# EAGLE design AMP_1_0 (EAGLE 8.3.2)
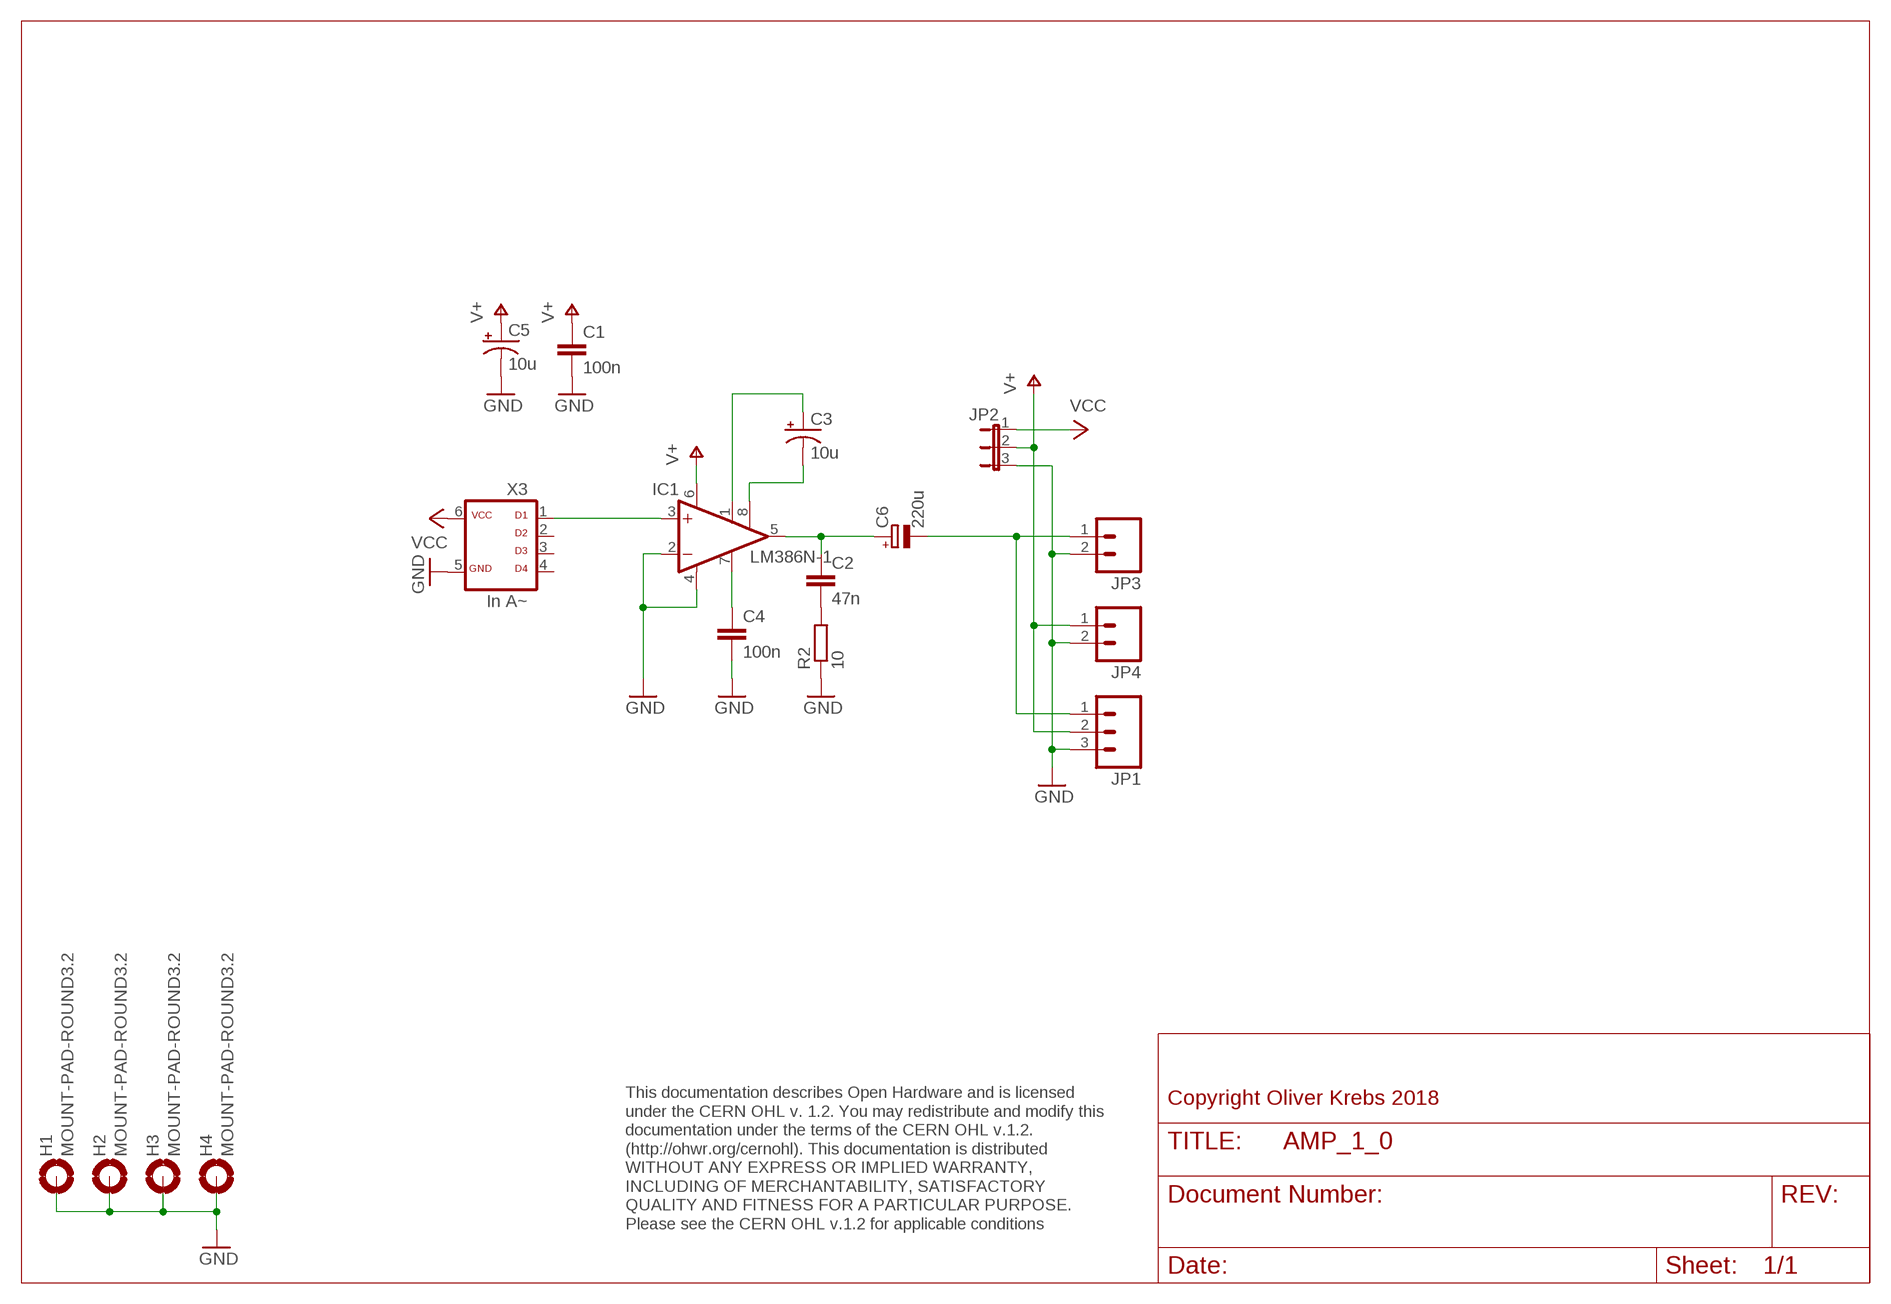
[diagram p0: schematic, sheet 1]

## Parts
C1  100n  C-EU050-025X075  [C050-025X075]
C2  47n  C-EU050-025X075  [C050-025X075]
C3  10u  CAP_POLPTH2  [CPOL-RADIAL-10UF-25V]
C4  100n  C-EU050-025X075  [C050-025X075]
C5  10u  CAP_POLPTH2  [CPOL-RADIAL-10UF-25V]
C6  220u  CPOL-EUE3.5-8  [E3,5-8]
H1  MOUNT-PAD-ROUND3.2  [3,2-PAD]
H2  MOUNT-PAD-ROUND3.2  [3,2-PAD]
H3  MOUNT-PAD-ROUND3.2  [3,2-PAD]
H4  MOUNT-PAD-ROUND3.2  [3,2-PAD]
IC1  LM386N-1  [DIL08]
JP1  M03PTH  [1X03]
JP2  JP2EJP2-U  [JP2-U]
JP3  M021.3MM-5.08  [1X02_BIG_5.08]
JP4  M021.3MM-5.08  [1X02_BIG_5.08]
R2  10  R-EU_0207/10  [0207/10]
X3  In A~  ML6D  [ML-6]

## Nets
GND: C1.2 C4.2 C5.2(-) H1.B3,2(MOUNT) H2.B3,2(MOUNT) H3.B3,2(MOUNT) H4.B3,2(MOUNT) IC1.2(-IN) IC1.4(GND) JP1.3 JP2.3 JP3.2 JP4.2 R2.1 X3.5
N$1: C3.2(-) IC1.8(GAIN)
N$2: C3.1(+) IC1.1(GAIN)
N$3: IC1.3(+IN) X3.1
N$8: C4.1 IC1.7(BYPASS)
N$9: C2.1 C6.+ IC1.5(OUT)
N$10: C2.2 R2.2
N$11: C6.- JP1.1 JP3.1
V+: C1.1 C5.1(+) IC1.6(VS) JP1.2 JP2.2 JP4.1
VCC: JP2.1 X3.6
Unconnected: X3.2 X3.3 X3.4

## Notes on the sheet
- Copyright Oliver Krebs 2018
- This documentation describes Open Hardware and is licensed 
  under the CERN OHL v. 1.2. You may redistribute and modify this 
  documentation under the terms of the CERN OHL v.1.2. 
  (http://ohwr.org/cernohl). This documentation is distributed
  WITHOUT ANY EXPRESS OR IMPLIED WARRANTY, 
  INCLUDING OF MERCHANTABILITY, SATISFACTORY 
  QUALITY AND FITNESS FOR A PARTICULAR PURPOSE. 
  Please see the CERN OHL v.1.2 for applicable conditions

## Library data of the parts
C1 C2 C4 = 01-my_rcl:C-EU: CAPACITOR, European symbol
C3 C5 = SparkFun-Passives:CAP_POL: Capacitor Polarized These are standard SMD and PTH capacitors. Normally 10uF, 47uF, and 100uF in electrolytic and tantalum varieties. Always verify the external diameter of the through hole cap, it varies with capacity, voltage, and manufacturer. The EIA devices should be standard.
C6 = 01-my_rcl:CPOL-EU: POLARIZED CAPACITOR, European symbol
H1-H4 = holes:MOUNT-PAD-ROUND: MOUNTING PAD, round
IC1 = 01-my-linear:LM386?-*: Low Voltage Audio Power Amplifier Source: http://cache.national.com/ds/LM/LM386.pdf
JP1 = SparkFun-Connectors:M03: Header 3 Standard 3-pin 0.1" header. Use with straight break away headers (SKU : PRT-00116), right angle break away headers (PRT-00553), swiss pins (PRT-00743), machine pins (PRT-00117), and female headers (PRT-00115). Molex polarized connector foot print use with SKU : PRT-08232 with associated crimp pins and housings.
JP2 = 01-my-jumper:JP2E: JUMPER
JP3 JP4 = SparkFun-Connectors:M02: Standard 2-pin 0.1" header. Use with - straight break away headers ( PRT-00116) - right angle break away headers (PRT-00553) - swiss pins (PRT-00743) - machine pins (PRT-00117) - female headers (PRT-00115) Molex polarized connector foot print use with: PRT-08233 with associated crimp pins and housings. 2.54_SCREWTERM for use with PRT-10571. 3.5mm Screw Terminal footprints for PRT-08084 5mm Screw Terminal footprints for use with PRT-08432
R2 = 01-my_rcl:R-EU_: RESISTOR, European symbol
X3 = 01-my-con:ML6D

## Board
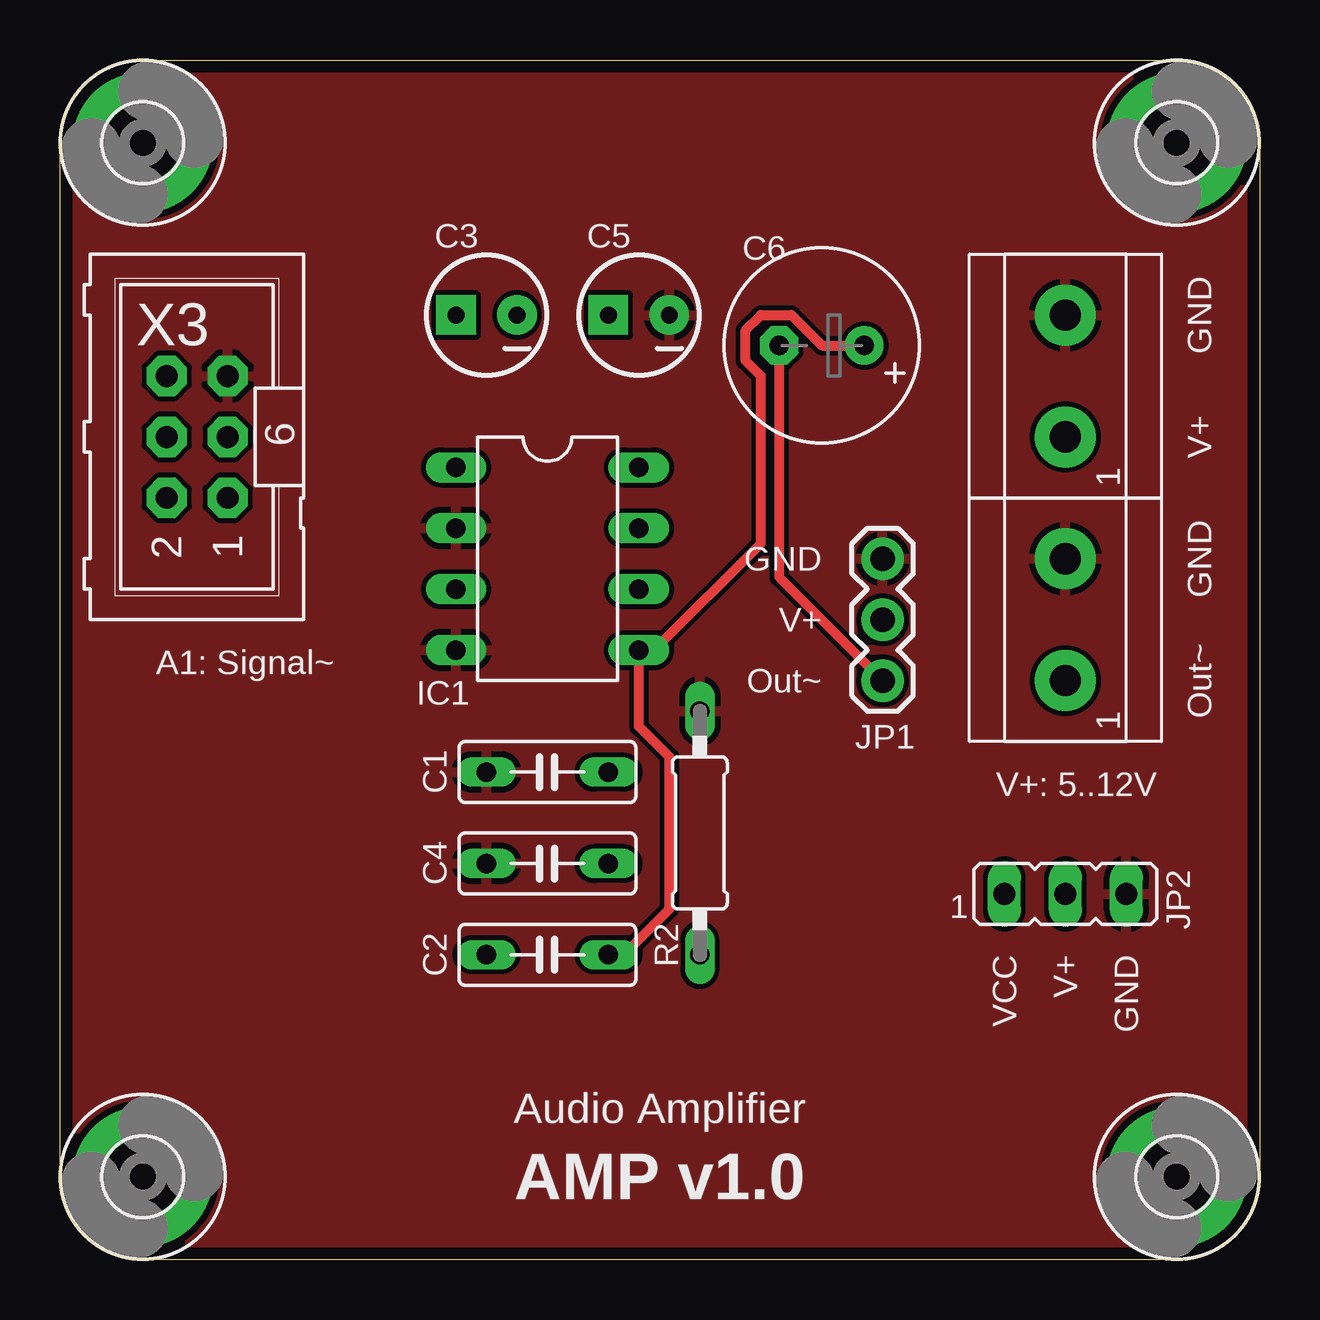
[diagram p1: board, top side]
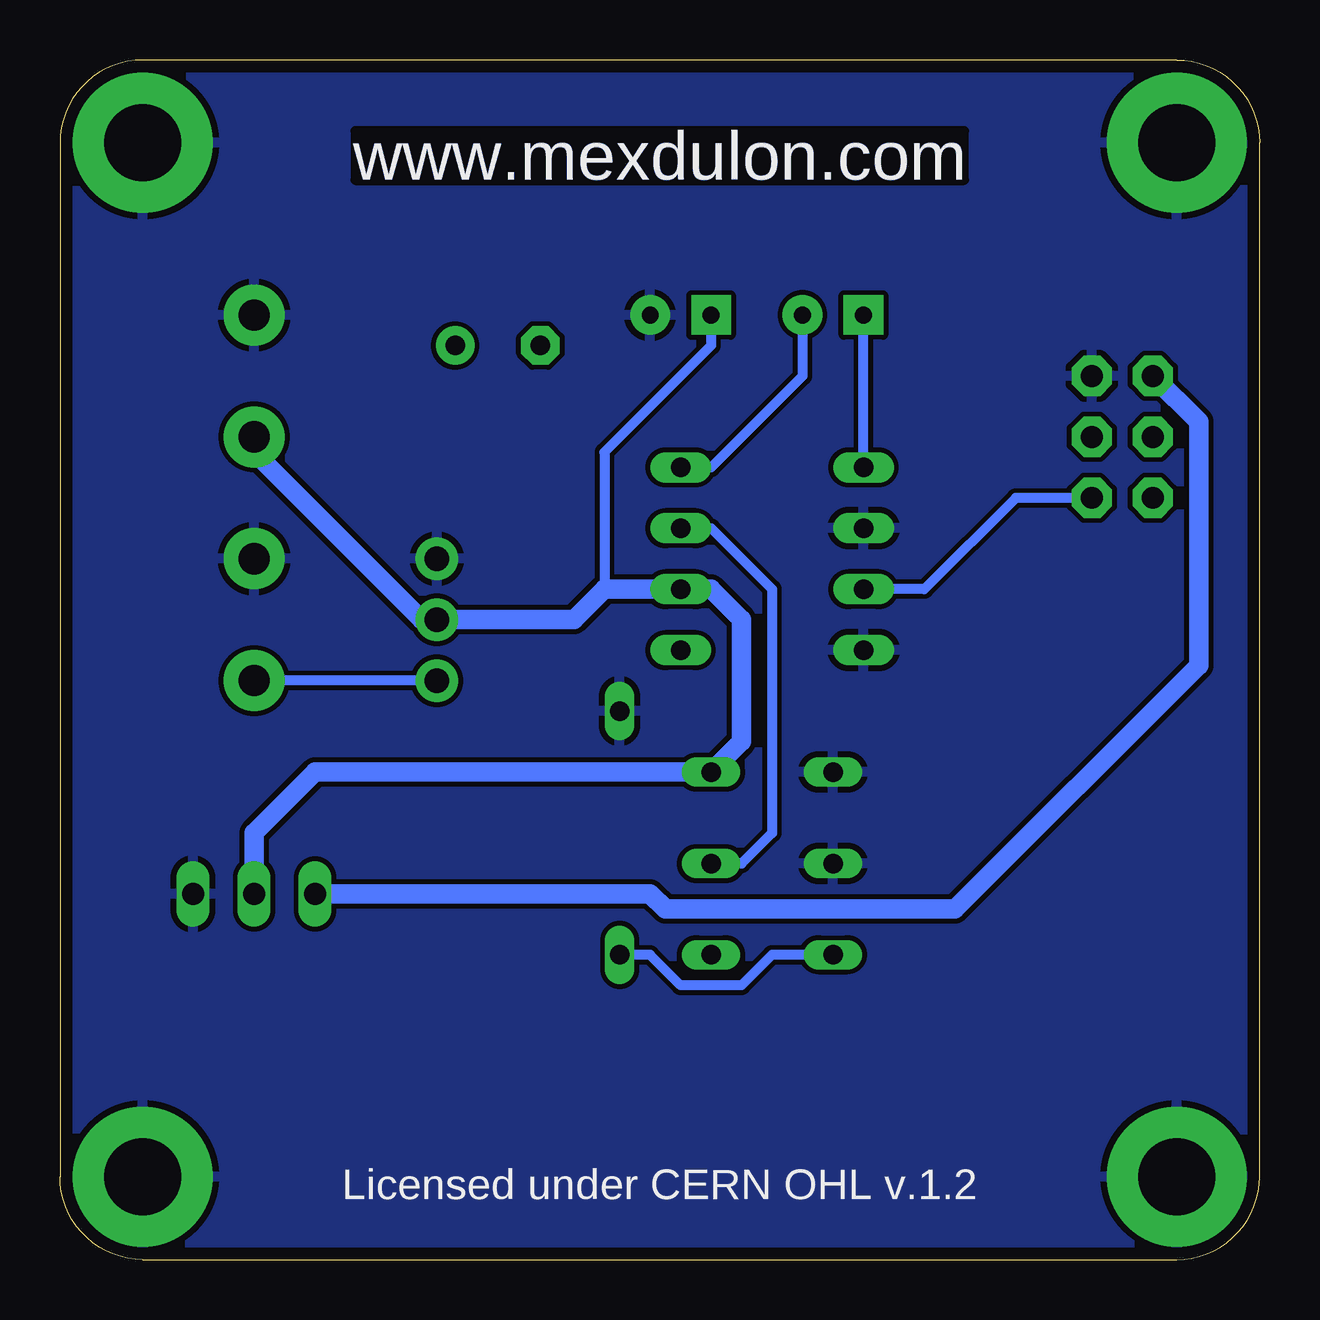
[diagram p2: board, bottom side, seen from below]

Size 50 x 50 mm. Coordinates in mm from the lower left corner, seen from the top.
Outline: 0,3.45 0,46.55 arc-90 3.45,50 46.55,50 arc-90 50,46.55 50,3.45 arc-90 46.55,0 3.45,0 arc-90 0,3.45
Copper layers (1*16): Top 0.035mm / dielectric 1.6mm / Bottom 0.035mm
Design rules "Elecrow_2-layer_PCB_eagle_rule_8mil": minimum track width 8mil, minimum drill 12mil, track to track 8mil, track to pad 8mil, pad to pad 8mil, via to via 8mil, smd to smd 0mil, copper to edge 20mil, drill to drill 10mil, minimum pad ring 6mil, minimum via ring 6mil, stop-mask expansion 0mil, vias tented up to drill 100mil, thermal gap 10mil

### Footprints (pad centres in the part's own frame; a part is rotated, then mirrored left to right if it is on the bottom)
C050-025X075 = drill 0.813 long: 1 -2.54,0; 2 2.54,0
CPOL-RADIAL-10UF-25V = drill 0.7 pad 1.651 square: 1 1.27,0 | drill 0.7 pad 1.651: 2 -1.27,0
E3,5-8 = drill 0.813 pad 1.6: + -1.778,0 | drill 0.813 pad 1.6 octagon: - 1.778,0
3,2-PAD = drill 3.2 pad 5.842: B3,2 0,0
DIL08 = drill 0.813 pad 1.27 long: 1 -3.81,-3.81; 2 -1.27,-3.81; 3 1.27,-3.81; 4 3.81,-3.81; 5 3.81,3.81; 6 1.27,3.81; 7 -1.27,3.81; 8 -3.81,3.81
1X03 = drill 1.016 pad 1.778: 1 0,0; 2 2.54,0; 3 5.08,0
JP2-U = drill 0.914 long: 1 -2.54,0; 2 0,0; 3 2.54,0
1X02_BIG_5.08 = drill 1.3 pad 2.54: 1 -2.54,0; 2 2.54,0
0207/10 = drill 0.813 long: 1 -5.08,0; 2 5.08,0
ML-6 = drill 0.914 pad 1.676 octagon: 1 -2.54,-1.27; 2 -2.54,1.27; 3 0,-1.27; 4 0,1.27; 5 2.54,-1.27; 6 2.54,1.27

### Placement (x,y rotation side)
C1  20.32,20.32 180 top
C2  20.32,12.7 180 top
C3  17.78,39.37 180 top
C4  20.32,16.51 180 top
C5  24.13,39.37 180 top
C6  31.75,38.1 180 top
H1  3.45,3.45 0 top
H2  3.45,46.55 0 top
H3  46.55,46.55 0 top
H4  46.55,3.45 0 top
IC1  20.32,29.21 270 top
JP1  34.29,24.13 90 top
JP2  41.91,15.24 0 top
JP3  41.91,26.67 90 top
JP4  41.91,36.83 90 top
R2  26.67,17.78 270 top
X3  5.71,34.29 90 top

### Tracks (layer width: path | path; a pad name or v marks a point on that pad's centre or on a via)
GND
  pour Bottom (isolate 0.203): 0,50.16 50.8,50.16 50.8,0 0,0
  pour Top (isolate 0.203): 0,50.16 50.8,50.16 50.8,0 0,0
N$1
  Bottom 0.406: C3.2 19.05,36.83 22.86,33.02 IC1.8
N$2
  Bottom 0.406: IC1.1 C3.1
N$3
  Bottom 0.406: X3.1 10.16,31.75 13.97,27.94 IC1.3
N$8
  Bottom 0.406: IC1.7 22.86,30.48 20.32,27.94 20.32,17.78 21.59,16.51 C4.1
N$9
  Top 0.406: C6.+ 31.75,38.1 30.48,39.37 29.21,39.37 28.57,38.73 28.57,37.47 29.21,36.83 29.21,29.84 24.77,25.4 IC1.5 24.13,22.23 25.4,20.95 25.4,14.61 23.5,12.7 C2.1
N$10
  Bottom 0.406: C2.2 20.32,12.7 21.59,11.43 24.13,11.43 25.4,12.7 R2.2
N$11
  Top 0.406: C6.- 29.97,28.45 JP1.1
  Bottom 0.406: JP1.1 JP3.1
V+
  Bottom 0.406: C5.1 22.86,38.1 27.3,33.66 27.3,27.94
  Bottom 0.813: JP4.1 41.91,33.66 34.92,26.67 JP1.2 28.57,26.67 27.3,27.94 IC1.6 22.86,27.94 21.59,26.67 21.59,21.59 C1.1 39.37,20.32 41.91,17.78 JP2.2
VCC
  Bottom 0.813: X3.6 2.54,34.92 2.54,24.77 12.7,14.61 24.77,14.61 25.4,15.24 JP2.1

### Text on the board
Bottom: www.mexdulon.com
tNames: GND | V+ | GND | GND | V+ | A1: Signal~ | Out~ | Out~ | V+: 5..12V | VCC | V+ | GND | Audio Amplifier | AMP v1.0
bNames: www.mexdulon.com | Licensed under CERN OHL v.1.2
200bmp: E:/Bilder/Elektronik/Modulion/Mexdulon/mexdulon_50x50_pcb.bmp